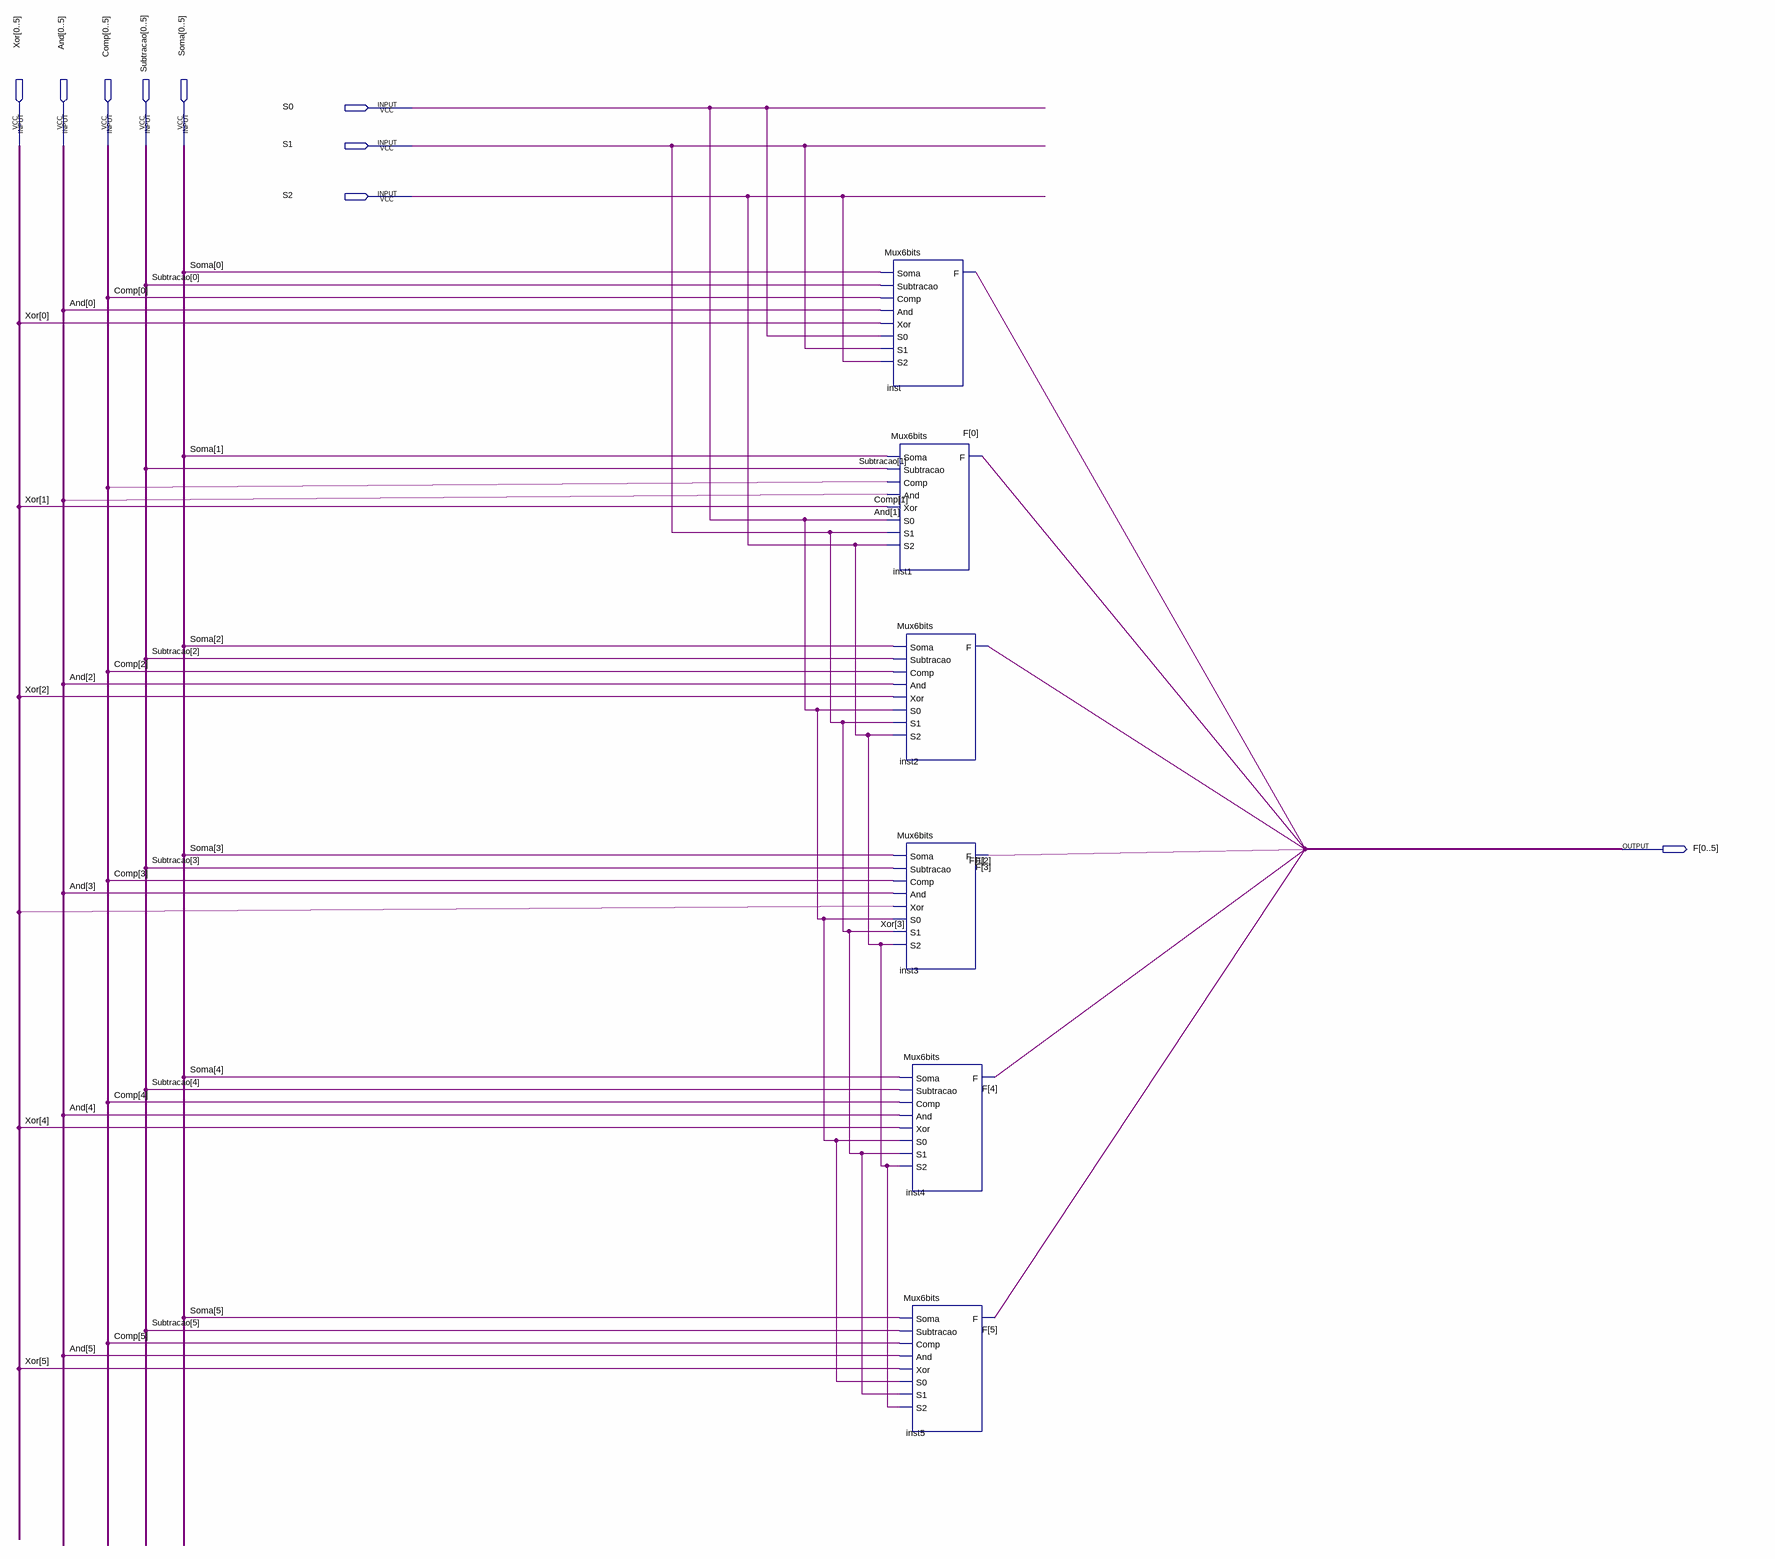
[diagram p0: schematic sheet]
// Quartus schematic Mux_ALu.bdf as structural Verilog: 6 symbols, 9 pins
module Mux_ALu (
  input  S0,
  input  [0:5] Xor,
  input  [0:5] And,
  input  [0:5] Comp,
  input  [0:5] Subtracao,
  input  [0:5] Soma,
  input  S1,
  input  S2,
  output [0:5] F
);

  Mux6bits inst (
    .Soma(Soma[0]), .Subtracao(Subtracao[0]), .Comp(Comp[0]), .And(And[0]), .Xor(Xor[0]), .S0(S0), .S1(S1),
    .S2(S2), .F(F[0]));
  Mux6bits inst1 (
    .Soma(Soma[1]), .Subtracao(Subtracao[1]), .Comp(Comp[1]), .And(And[1]), .Xor(Xor[1]), .S0(S0), .S1(S1),
    .S2(S2), .F(F[1]));
  Mux6bits inst2 (
    .Soma(Soma[2]), .Subtracao(Subtracao[2]), .Comp(Comp[2]), .And(And[2]), .Xor(Xor[2]), .S0(S0), .S1(S1),
    .S2(S2), .F(F[2]));
  Mux6bits inst3 (
    .Soma(Soma[3]), .Subtracao(Subtracao[3]), .Comp(Comp[3]), .And(And[3]), .Xor(Xor[3]), .S0(S0), .S1(S1),
    .S2(S2), .F(F[3]));
  Mux6bits inst4 (
    .Soma(Soma[4]), .Subtracao(Subtracao[4]), .Comp(Comp[4]), .And(And[4]), .Xor(Xor[4]), .S0(S0), .S1(S1),
    .S2(S2), .F(F[4]));
  Mux6bits inst5 (
    .Soma(Soma[5]), .Subtracao(Subtracao[5]), .Comp(Comp[5]), .And(And[5]), .Xor(Xor[5]), .S0(S0), .S1(S1),
    .S2(S2), .F(F[5]));
endmodule
